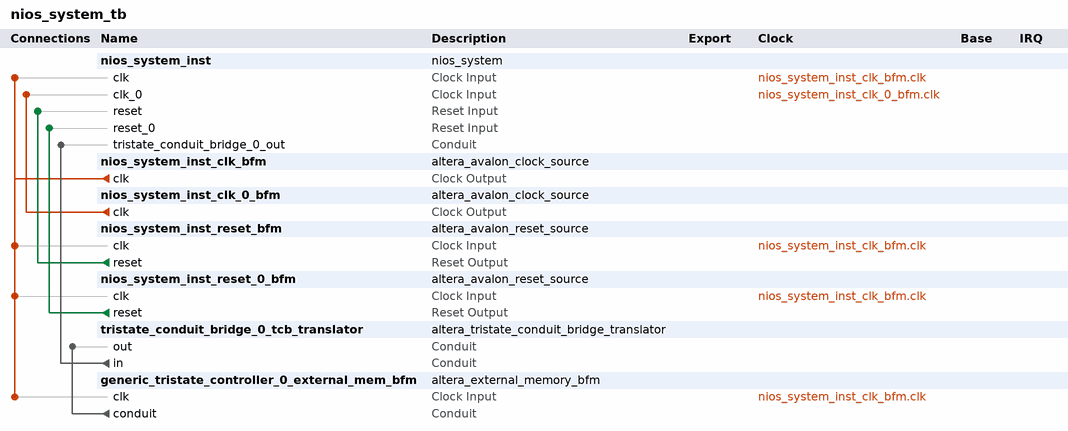
[diagram p0: system contents]
# Platform Designer (Qsys) system nios_system_tb, Cyclone IV E EP4CE115F29C7
# Parameters at their usual value, and those the tool derives, are not listed.
package require -exact qsys 17.0
create_system nios_system_tb
set_project_property DEVICE_FAMILY {Cyclone IV E}
set_project_property DEVICE EP4CE115F29C7

add_instance nios_system_inst nios_system 1.0

add_instance nios_system_inst_clk_bfm altera_avalon_clock_source 17.0

add_instance nios_system_inst_clk_0_bfm altera_avalon_clock_source 17.0
set_instance_parameter_value nios_system_inst_clk_0_bfm CLOCK_RATE 25000000

add_instance nios_system_inst_reset_bfm altera_avalon_reset_source 17.0
set_instance_parameter_value nios_system_inst_reset_bfm ASSERT_HIGH_RESET 0
set_instance_parameter_value nios_system_inst_reset_bfm INITIAL_RESET_CYCLES 50

add_instance nios_system_inst_reset_0_bfm altera_avalon_reset_source 17.0
set_instance_parameter_value nios_system_inst_reset_0_bfm ASSERT_HIGH_RESET 0
set_instance_parameter_value nios_system_inst_reset_0_bfm INITIAL_RESET_CYCLES 50

add_instance tristate_conduit_bridge_0_tcb_translator altera_tristate_conduit_bridge_translator 17.0
set_instance_parameter_value tristate_conduit_bridge_0_tcb_translator CHAIN_LENGTH 4
set_instance_parameter_value tristate_conduit_bridge_0_tcb_translator MODULE_ORIGIN_LIST generic_tristate_controller_0.tcm,generic_tristate_controller_0.tcm,generic_tristate_controller_0.tcm,generic_tristate_controller_0.tcm,generic_tristate_controller_0.tcm
set_instance_parameter_value tristate_conduit_bridge_0_tcb_translator SIGNAL_ORIGIN_LIST tcm_address_out,tcm_read_n_out,tcm_write_n_out,tcm_data_out,tcm_chipselect_n_out
set_instance_parameter_value tristate_conduit_bridge_0_tcb_translator SIGNAL_ORIGIN_TYPE Output,Output,Output,Bidirectional,Output
set_instance_parameter_value tristate_conduit_bridge_0_tcb_translator SIGNAL_ORIGIN_WIDTH 23,1,1,8,1

add_instance generic_tristate_controller_0_external_mem_bfm altera_external_memory_bfm 17.0
set_instance_parameter_value generic_tristate_controller_0_external_mem_bfm ACTIVE_LOW_BEGINTRANSFER 0
set_instance_parameter_value generic_tristate_controller_0_external_mem_bfm ACTIVE_LOW_BYTEENABLE 0
set_instance_parameter_value generic_tristate_controller_0_external_mem_bfm ACTIVE_LOW_CHIPSELECT 1
set_instance_parameter_value generic_tristate_controller_0_external_mem_bfm ACTIVE_LOW_OUTPUTENABLE 0
set_instance_parameter_value generic_tristate_controller_0_external_mem_bfm ACTIVE_LOW_READ 1
set_instance_parameter_value generic_tristate_controller_0_external_mem_bfm ACTIVE_LOW_RESET 0
set_instance_parameter_value generic_tristate_controller_0_external_mem_bfm ACTIVE_LOW_WRITE 1
set_instance_parameter_value generic_tristate_controller_0_external_mem_bfm CDT_ADDRESS_W 23
set_instance_parameter_value generic_tristate_controller_0_external_mem_bfm CDT_NUMSYMBOLS 1
set_instance_parameter_value generic_tristate_controller_0_external_mem_bfm CDT_READ_LATENCY 0
set_instance_parameter_value generic_tristate_controller_0_external_mem_bfm CDT_SYMBOL_W 8
set_instance_parameter_value generic_tristate_controller_0_external_mem_bfm INIT_FILE altera_external_memory_bfm.hex
set_instance_parameter_value generic_tristate_controller_0_external_mem_bfm SIGNAL_ADDRESS_ROLES tcm_address_out
set_instance_parameter_value generic_tristate_controller_0_external_mem_bfm SIGNAL_BEGINTRANSFER_ROLES tcm_begintransfer_out
set_instance_parameter_value generic_tristate_controller_0_external_mem_bfm SIGNAL_BYTEENABLE_ROLES tcm_byteenable_out
set_instance_parameter_value generic_tristate_controller_0_external_mem_bfm SIGNAL_CHIPSELECT_ROLES tcm_chipselect_n_out
set_instance_parameter_value generic_tristate_controller_0_external_mem_bfm SIGNAL_DATA_ROLES tcm_data_out
set_instance_parameter_value generic_tristate_controller_0_external_mem_bfm SIGNAL_OUTPUTENABLE_ROLES tcm_outputenable_out
set_instance_parameter_value generic_tristate_controller_0_external_mem_bfm SIGNAL_READ_ROLES tcm_read_n_out
set_instance_parameter_value generic_tristate_controller_0_external_mem_bfm SIGNAL_RESET_ROLES tcm_reset_out
set_instance_parameter_value generic_tristate_controller_0_external_mem_bfm SIGNAL_WRITE_ROLES tcm_write_n_out
set_instance_parameter_value generic_tristate_controller_0_external_mem_bfm USE_BEGINTRANSFER 0
set_instance_parameter_value generic_tristate_controller_0_external_mem_bfm USE_BYTEENABLE 0
set_instance_parameter_value generic_tristate_controller_0_external_mem_bfm USE_CHIPSELECT 1
set_instance_parameter_value generic_tristate_controller_0_external_mem_bfm USE_OUTPUTENABLE 0
set_instance_parameter_value generic_tristate_controller_0_external_mem_bfm USE_READ 1
set_instance_parameter_value generic_tristate_controller_0_external_mem_bfm USE_RESET 0
set_instance_parameter_value generic_tristate_controller_0_external_mem_bfm USE_WRITE 1
set_instance_parameter_value generic_tristate_controller_0_external_mem_bfm VHDL_ID 0

# connections
add_connection nios_system_inst_clk_0_bfm.clk nios_system_inst.clk_0 clock
add_connection nios_system_inst_clk_bfm.clk generic_tristate_controller_0_external_mem_bfm.clk clock
add_connection nios_system_inst_clk_bfm.clk nios_system_inst.clk clock
add_connection nios_system_inst_clk_bfm.clk nios_system_inst_reset_0_bfm.clk clock
add_connection nios_system_inst_clk_bfm.clk nios_system_inst_reset_bfm.clk clock
add_connection nios_system_inst_reset_0_bfm.reset nios_system_inst.reset_0 reset
add_connection nios_system_inst_reset_bfm.reset nios_system_inst.reset reset
add_connection generic_tristate_controller_0_external_mem_bfm.conduit tristate_conduit_bridge_0_tcb_translator.out conduit
add_connection tristate_conduit_bridge_0_tcb_translator.in nios_system_inst.tristate_conduit_bridge_0_out conduit

set_interconnect_requirement {$system} qsys_mm.clockCrossingAdapter HANDSHAKE
set_interconnect_requirement {$system} qsys_mm.enableEccProtection FALSE
set_interconnect_requirement {$system} qsys_mm.insertDefaultSlave FALSE
set_interconnect_requirement {$system} qsys_mm.maxAdditionalLatency 1

save_system nios_system_tb.qsys
